# EAGLE schematic layout (EAGLE 6.2)
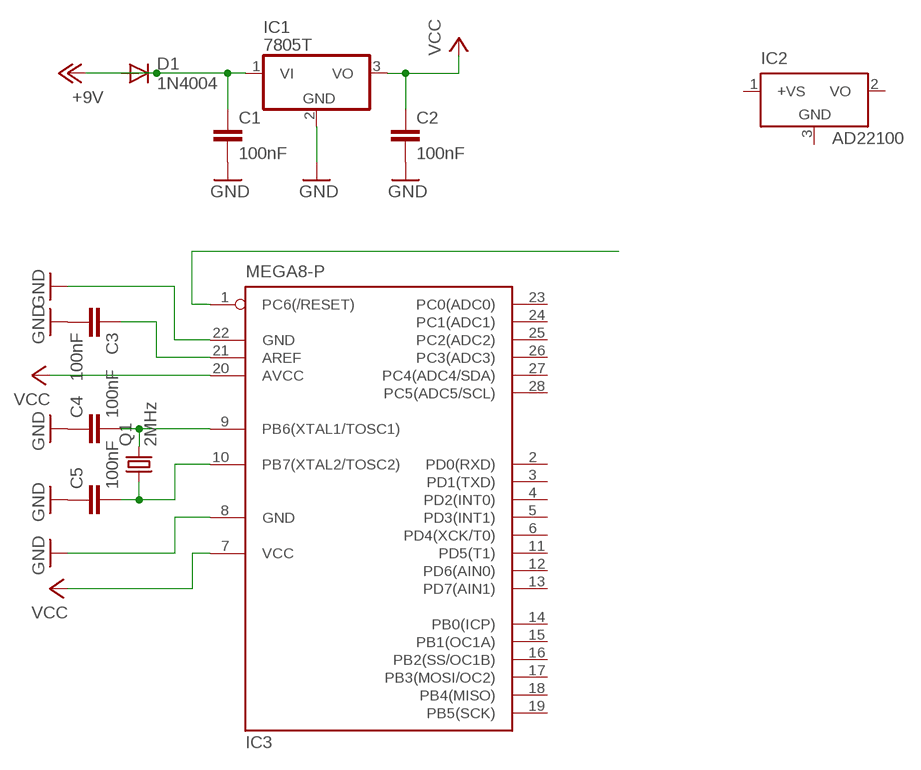
[diagram p0: schematic, sheet 1]

## Parts
C1  100nF  C-EU025-024X044  [C025-024X044]
C2  100nF  C-EU025-024X044  [C025-024X044]
C3  100nF  C-EU025-024X044  [C025-024X044]
C4  100nF  C-EU025-024X044  [C025-024X044]
C5  100nF  C-EU025-024X044  [C025-024X044]
D1  1N4004  [DO41-10]
IC1  7805T  [TO220H]
IC2  AD22100  LM50  [SOT23]
IC3  MEGA8-P  [DIL28-3]
Q1  2MHz  CRYSTAL68SMX  [86SMX]

## Nets
+12V: C1.1 D1.A D1.C IC1.1(VI) ; supply symbol labelled +9V
GND: C1.2 C2.2 C3.2 C5.1 IC1.2(GND) IC3.8(GND) IC3.22(GND)
N$1: C4.2 IC3.9(PB6(XTAL1/TOSC1)) Q1.4
N$2: C3.1 IC3.21(AREF)
N$3: C5.2 IC3.10(PB7(XTAL2/TOSC2)) Q1.1
N$4: IC3.1(PC6(/RESET))
VCC: C2.1 IC1.3(VO) IC3.7(VCC) IC3.20(AVCC)
Unconnected: C4.1 IC2.1(+VS) IC2.2(VO) IC3.2(PD0(RXD)) IC3.3(PD1(TXD)) IC3.4(PD2(INT0)) IC3.5(PD3(INT1)) IC3.6(PD4(XCK/T0)) IC3.11(PD5(T1)) IC3.12(PD6(AIN0)) IC3.13(PD7(AIN1)) IC3.14(PB0(ICP)) IC3.15(PB1(OC1A)) IC3.16(PB2(SS/OC1B)) IC3.17(PB3(MOSI/OC2)) IC3.18(PB4(MISO)) IC3.19(PB5(SCK)) IC3.23(PC0(ADC0)) IC3.24(PC1(ADC1)) IC3.25(PC2(ADC2)) IC3.26(PC3(ADC3)) IC3.27(PC4(ADC4/SDA)) IC3.28(PC5(ADC5/SCL))

## Power pins joined to a net without a drawn wire
GND: IC2.3(GND)

## Library data of the parts
C1-C5 = rcl:C-EU: CAPACITOR, European symbol
D1 = diode:1N4004: DIODE general purpose rectifier, 1 A
IC1 = linear:78*: Positive VOLTAGE REGULATOR Source: http://cache.national.com/ds/LM/LM78L05.pdf http://www.fairchildsemi.com/ds/LM/LM7805.pdf
IC2 = linear:LM50: SOT-23 Single-Supply Centigrade Temperature Sensor Vout = (10mV/°C x Temp °C) +5mmmV Source: http://cache.national.com/ds/LM/LM50.pdf
IC3 = atmel:MEGA8-P: MICROCONTROLLER 8 Kbytes FLASH, 1 kbytes SRAM, 512 bytes EEPROM, USART, 4-channel 10 bit ADC, 2-channel 8 bit ADC Pin compatible with Atmega48, ATMega88, ATMega168 Source: avr.lbr; OC_FARNELL: unknown; OC_NEWARK: unknown
Q1 = crystal:CRYSTAL: CRYSTAL; OC_FARNELL: 6344860; OC_NEWARK: unknown